# Altium schematic sheet Quad 2x1 mux.SchDoc: Quad 2x1 mux
size A4; SheetNumber: 1; SheetTotal: 1; PartNumber: PNxxx; Drawn By: Sebastian Kulik; ProjectName: DVT SPI Buffer
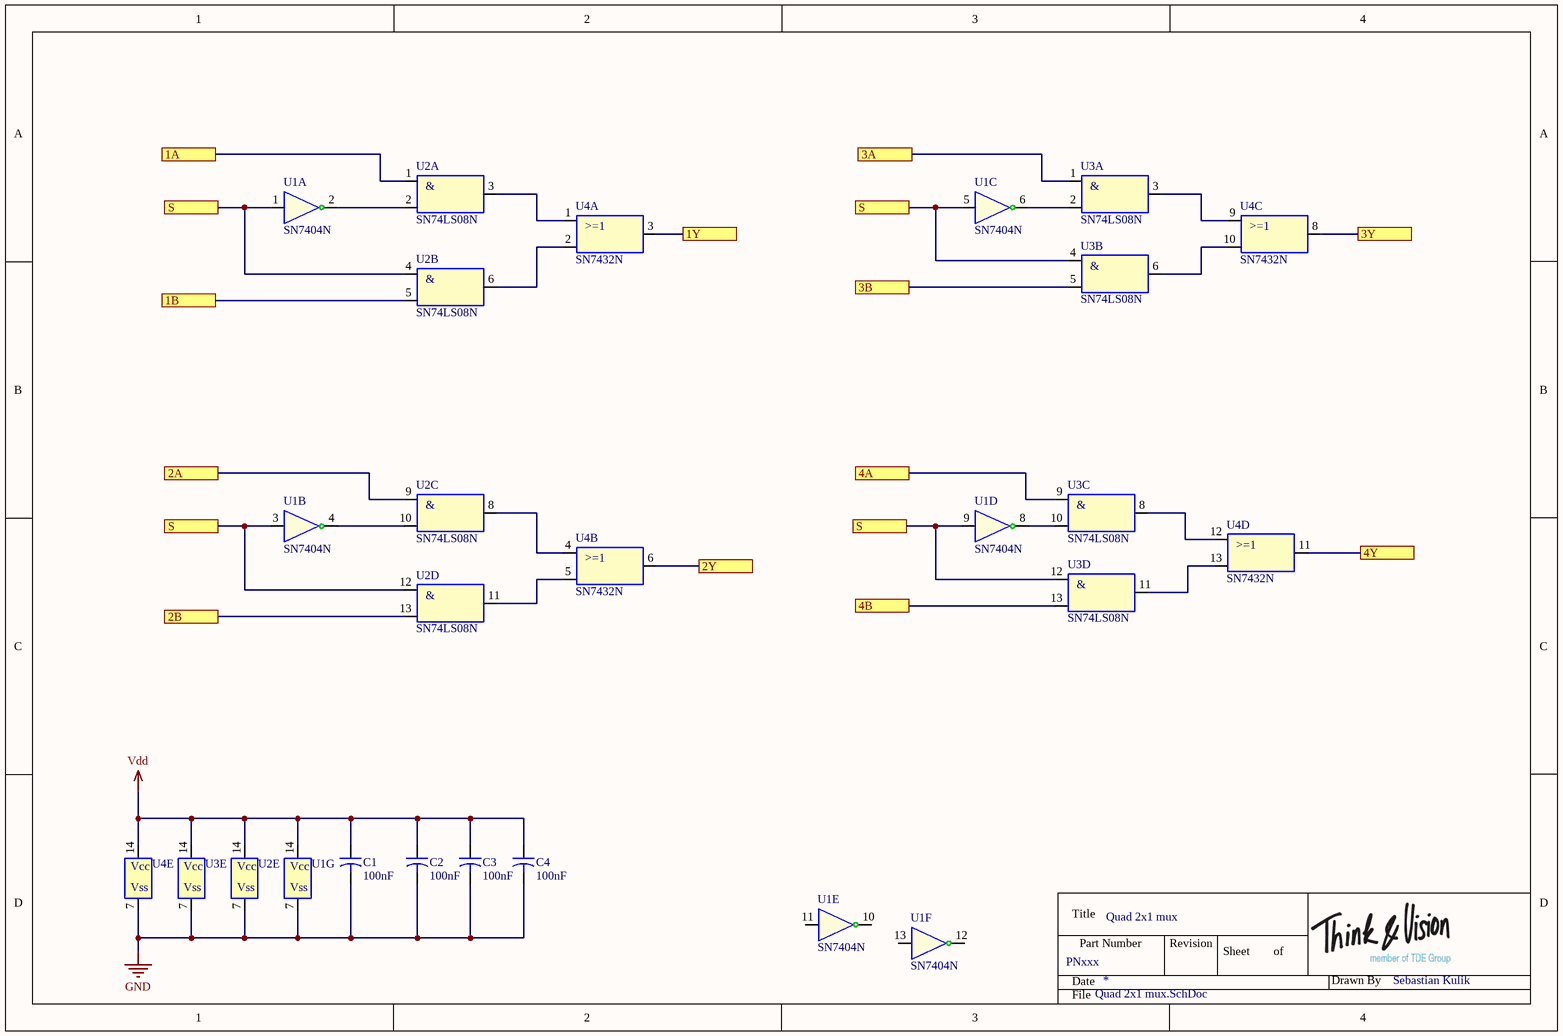
[diagram p0: Quad 2x1 mux.SchDoc]

## Parts
C1  value 100nF  [Dummy-10mm]  (hidden comment: Capacitor-Dummy-THT)
C2  value 100nF  [Dummy-10mm]  (hidden comment: Capacitor-Dummy-THT)
C3  value 100nF  [Dummy-10mm]  (hidden comment: Capacitor-Dummy-THT)
C4  value 100nF  [Dummy-10mm]  (hidden comment: Capacitor-Dummy-THT)
U1  SN7404N  [DIP-14]  (parts A,B,C,D,E,F,G of 7)
U2  SN74LS08N  [DIP-14]  (parts A,B,C,D,E of 5)
U3  SN74LS08N  [DIP-14]  (parts A,B,C,D,E of 5)
U4  SN7432N  [DIP-14]  (parts A,B,C,D,E of 5)

## Ports
1A, 1B, 1Y, 2A, 2B, 2Y, 3A, 3B, 3Y, 4A, 4B, 4Y, S

## Nets
GND: C1.2 C2.2 C3.2 C4.2 U1.7(Vss) U2.7(Vss) U3.7(Vss) U4.7(Vss)
Vdd: C1.1 C2.1 C3.1 C4.1 U1.14(Vcc) U2.14(Vcc) U3.14(Vcc) U4.14(Vcc)
1A: U2.1(1A) ; port 1A
1B: U2.5(2B) ; port 1B
1Y: U4.3(Y1) ; port 1Y
2A: U2.9(3A) ; port 2A
2B: U2.13(4B) ; port 2B
2Y: U4.6(Y2) ; port 2Y
3A: U3.1(1A) ; port 3A
3B: U3.5(2B) ; port 3B
3Y: U4.8(Y3) ; port 3Y
4A: U3.9(3A) ; port 4A
4B: U3.13(4B) ; port 4B
4Y: U4.11(Y4) ; port 4Y
S: U1.1(1A) U1.3(2A) U1.5(3A) U1.9(4A) U2.4(2A) U2.12(4A) U3.4(2A) U3.12(4A) ; port S
NetU1_2: U1.2(1Y) U2.2(1B)
NetU1_4: U1.4(2Y) U2.10(3B)
NetU1_6: U1.6(3Y) U3.2(1B)
NetU1_8: U1.8(Y4) U3.10(3B)
NetU2_3: U2.3(Y1) U4.1(1A)
NetU2_6: U2.6(Y2) U4.2(1B)
NetU2_8: U2.8(Y3) U4.4(2A)
NetU2_11: U2.11(Y4) U4.5(2B)
NetU3_3: U3.3(Y1) U4.9(3A)
NetU3_6: U3.6(Y2) U4.10(3B)
NetU3_8: U3.8(Y3) U4.12(4A)
NetU3_11: U3.11(Y4) U4.13(4B)

Not connected (* = marked no-connect by the designer): U1 10(5Y) 11(5A) 12(6Y) 13(6A)

## Notes on the sheet
- Title
- Date
- Part Number
- Revision
- Sheet
- of
- Drawn By
- File
- (in symbol SN74LS08N, part A) &
- (in symbol SN74LS08N, part B) &
- (in symbol SN74LS08N, part C) &
- (in symbol SN74LS08N, part D) &
- (in symbol SN7432N, part A) >=1
- (in symbol SN7432N, part B) >=1
- (in symbol SN7432N, part C) >=1
- (in symbol SN7432N, part D) >=1

## Library data of the parts
C1-C4 = Capacitor-Dummy-THT: Deliverer PartNr: 721-5240; Deliverer: RS; Published: 08.12.2015; Part Description: Capacitor-Dummy-THT; Publisher: Sebastian Kulik; PackageDescription: -; Manufacturer: -; Manufacturer PartNr: -; TDE-PN: -; Price: 0.081/50
U1 = SN7404N: Hex Inverter TTL; Deliverer PartNr: 305-529; Manufacturer: TI; Deliverer: RS; TDE-PN: IC0086; Published: 24.11.2016; PackageDescription: DIP14; Publisher: Sebastian Kulik; Manufacturer PartNr: SN7404N; Price: 1
U2 U3 = SN74LS08N: Quad AND, TTL; Deliverer PartNr: 307-519; Manufacturer: TI; Deliverer: RS; TDE-PN: IC0088; Published: 24.11.2016; PackageDescription: DIP14; Publisher: Sebastian Kulik; Manufacturer PartNr: SN74LS08N; Price: 0.56
U4 = SN7432N: Quad NAND, TTL; Deliverer PartNr: 304-093; Manufacturer: TI; Deliverer: RS; TDE-PN: IC0087; Published: 24.11.2016; PackageDescription: DIP14; Publisher: Sebastian Kulik; Manufacturer PartNr: SN7432N; Price: 1.24